# Altium project DL5-1AA.PrjPcb (part 2 of 3)

## Sheet PoE_Injector.SchDoc: IEEE 802.3AF/AT PSE Controller
size A3; CompanyName: FSCH; DrawnBy: ahorat / daniw; Engineer: ahorat / daniw; Address1: FS Switzerland; Address2: Zeltweg 57; Address3: 8032 Zürich; SheetNumber: 5; SheetTotal: 9
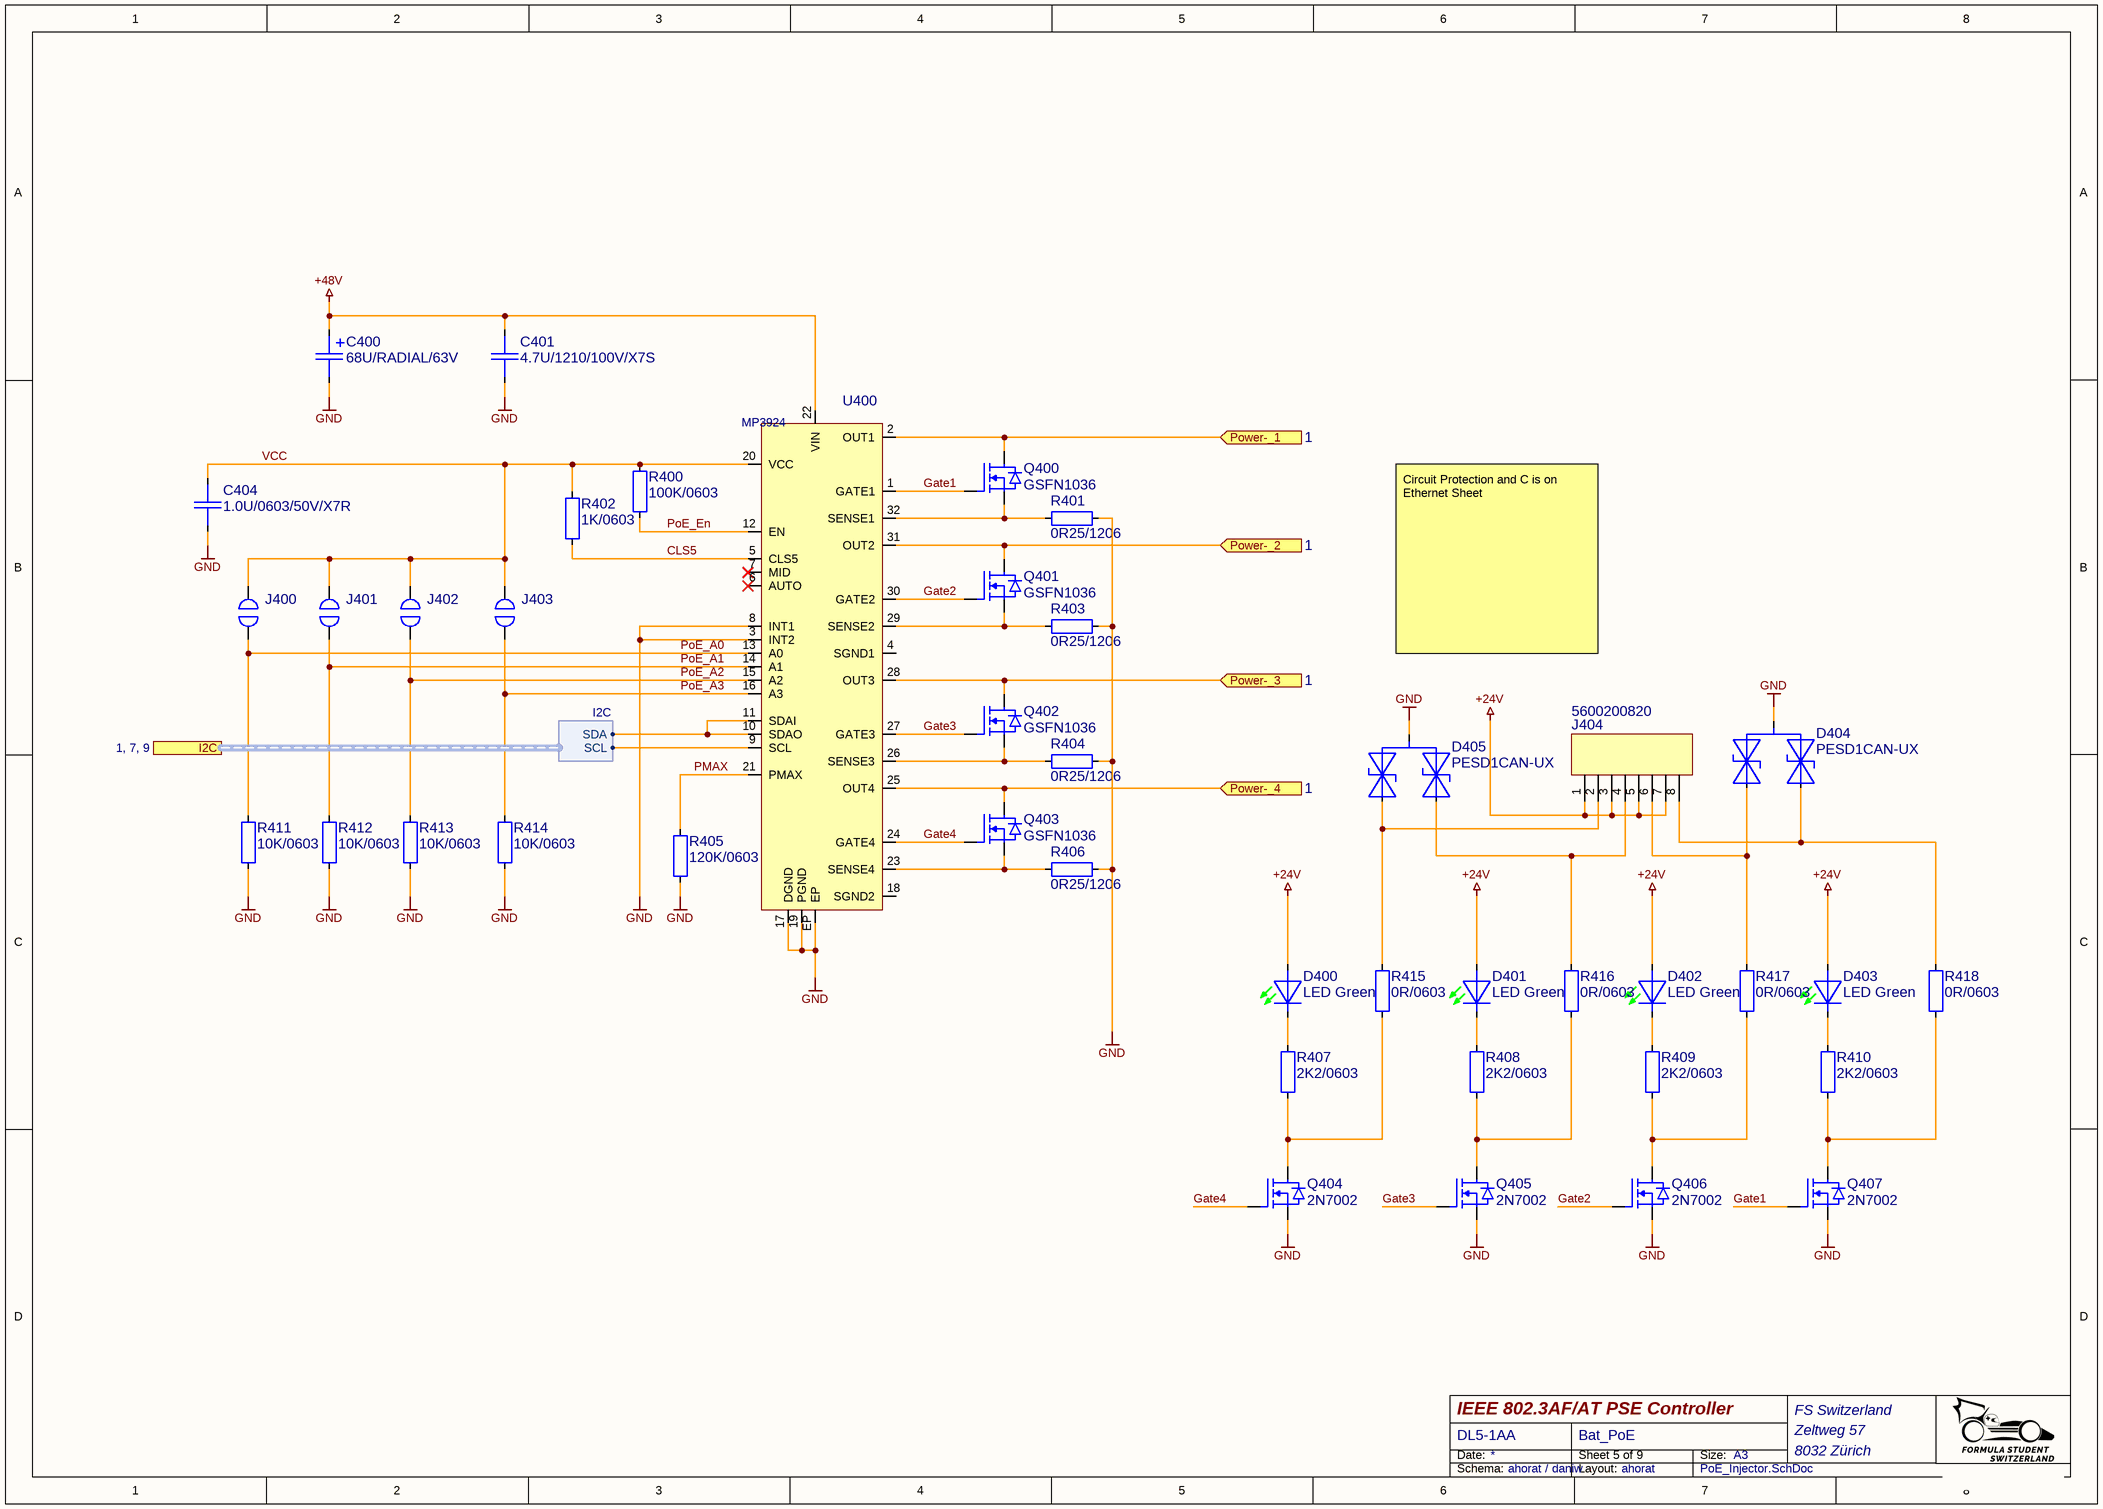
[diagram p4: PoE_Injector.SchDoc]

### Parts
C400  68U/RADIAL/63V  [CAP350P80X130]
C401  4.7U/1210/100V/X7S  [CAP1210_X7R]
C404  1.0U/0603/50V/X7R  [CAP0603_X7R]
D400  LED Green  [LED0603_GREEN]
D401  LED Green  [LED0603_GREEN]
D402  LED Green  [LED0603_GREEN]
D403  LED Green  [LED0603_GREEN]
D404  PESD1CAN-UX  [SOT65P210X95-3-SE]
D405  PESD1CAN-UX  [SOT65P210X95-3-SE]
J400  Solder Jumper 2pin 0.2mm small  [Solder_Jumper_2pin_0.2mm_small]  (value not drawn)
J401  Solder Jumper 2pin 0.2mm small  [Solder_Jumper_2pin_0.2mm_small]  (value not drawn)
J402  Solder Jumper 2pin 0.2mm small  [Solder_Jumper_2pin_0.2mm_small]  (value not drawn)
J403  Solder Jumper 2pin 0.2mm small  [Solder_Jumper_2pin_0.2mm_small]  (value not drawn)
J404  5600200820  [5600200820]
Q400  GSFN1036  [SON065P330X330X075-5-TH245X175]
Q401  GSFN1036  [SON065P330X330X075-5-TH245X175]
Q402  GSFN1036  [SON065P330X330X075-5-TH245X175]
Q403  GSFN1036  [SON065P330X330X075-5-TH245X175]
Q404  2N7002  [SOT2395P280X125-3-SE]
Q405  2N7002  [SOT2395P280X125-3-SE]
Q406  2N7002  [SOT2395P280X125-3-SE]
Q407  2N7002  [SOT2395P280X125-3-SE]
R400  100K/0603  [R0603-0.40-WW]
R401  0R25/1206  [R1206-0.80-WW]
R402  1K/0603  [R0603-0.40-WW]
R403  0R25/1206  [R1206-0.80-WW]
R404  0R25/1206  [R1206-0.80-WW]
R405  120K/0603  [R0603-0.40-WW]
R406  0R25/1206  [R1206-0.80-WW]
R407  2K2/0603  [R0603-0.40-WW]
R408  2K2/0603  [R0603-0.40-WW]
R409  2K2/0603  [R0603-0.40-WW]
R410  2K2/0603  [R0603-0.40-WW]
R411  10K/0603  [R0603-0.40-WW]
R412  10K/0603  [R0603-0.40-WW]
R413  10K/0603  [R0603-0.40-WW]
R414  10K/0603  [R0603-0.40-WW]
R415  0R/0603  [R0603-0.40-WW]
R416  0R/0603  [R0603-0.40-WW]
R417  0R/0603  [R0603-0.40-WW]
R418  0R/0603  [R0603-0.40-WW]
U400  MP3924  [QFN050P500X500X100-32-TH360X360]

### Ports
I2C (harness I2C, see 1, 7, 9), Power-_1 (in, see 1), Power-_2 (in, see 1), Power-_3 (in, see 1), Power-_4 (in, see 1)

### Harnesses
I2C: SCL, SDA

### Nets
+24V: D400.2 D401.2 D402.2 D403.2 J404.1 J404.3 J404.5 J404.7
+48V: C400.1 C401.1 U400.22(VIN)
GND: C400.2 C401.2 C404.2 D404.3 D405.3 Q404.2(SOURCE) Q405.2(SOURCE) Q406.2(SOURCE) Q407.2(SOURCE) R401.2 R403.2 R404.2 R405.2 R406.2 R411.2 R412.2 R413.2 R414.2 U400.3(INT2) U400.8(INT1) U400.17(DGND) U400.19(PGND) U400.EP
CLS5: R402.2 U400.5(CLS5)
Gate1: Q400.G(GATE) Q407.1(GATE) U400.1(GATE1)
Gate2: Q401.G(GATE) Q406.1(GATE) U400.30(GATE2)
Gate3: Q402.G(GATE) Q405.1(GATE) U400.27(GATE3)
Gate4: Q403.G(GATE) Q404.1(GATE) U400.24(GATE4)
I2C.SCL: U400.9(SCL) ; port I2C.SCL
I2C.SDA: U400.10(SDAO) U400.11(SDAI) ; port I2C.SDA
PMAX: R405.1 U400.21(PMAX)
PoE_A0: J400.2 R411.1 U400.13(A0)
PoE_A1: J401.2 R412.1 U400.14(A1)
PoE_A2: J402.2 R413.1 U400.15(A2)
PoE_A3: J403.2 R414.1 U400.16(A3)
PoE_En: R400.2 U400.12(EN)
VCC: C404.1 J400.1 J401.1 J402.1 J403.1 R400.1 R402.1 U400.20(VCC)
NetC510_Ethernet_Channel_1_2: Q400.D(DRAIN) U400.2(OUT1) ; port Power-_1
NetC510_Ethernet_Channel_2_2: Q401.D(DRAIN) U400.31(OUT2) ; port Power-_2
NetC510_Ethernet_Channel_3_2: Q402.D(DRAIN) U400.28(OUT3) ; port Power-_3
NetC510_Ethernet_Channel_4_2: Q403.D(DRAIN) U400.25(OUT4) ; port Power-_4
NetD400_1: D400.1 R407.1
NetD401_1: D401.1 R408.1
NetD402_1: D402.1 R409.1
NetD403_1: D403.1 R410.1
NetD404_1: D404.1 J404.8 R418.1
NetD404_2: D404.2 J404.6 R417.1
NetD405_1: D405.1 J404.4 R416.1
NetD405_2: D405.2 J404.2 R415.1
NetQ400_S: Q400.S(SOURCE) R401.1 U400.32(SENSE1)
NetQ401_S: Q401.S(SOURCE) R403.1 U400.29(SENSE2)
NetQ402_S: Q402.S(SOURCE) R404.1 U400.26(SENSE3)
NetQ403_S: Q403.S(SOURCE) R406.1 U400.23(SENSE4)
NetQ404_3: Q404.3(DRAIN) R407.2 R415.2
NetQ405_3: Q405.3(DRAIN) R408.2 R416.2
NetQ406_3: Q406.3(DRAIN) R409.2 R417.2
NetQ407_3: Q407.3(DRAIN) R410.2 R418.2

Not connected (* = marked no-connect by the designer): U400 4(SGND1) 6(AUTO)* 7(MID)* 18(SGND2)

### Notes on the sheet
- Circuit Protection and C is on Ethernet Sheet
- Date:
- Size:
- A3
- Schema:
- Layout:

### Library data of the parts
C400 = 68U/RADIAL/63V: CAP THT 8C130 68UF ELKO 63V; Manufacturer: GENERIC; Manufacturer 1: Würth Elektronik; Manufacturer Part Number 1: 860020774014; Absolute Value: 6.8E-5; Part Number: 68U/RADIAL/63V; Package: RADIAL; Value: 68UF; HelpURL: https://www.we-online.com/components/products/datasheet/860020774014.pdf; Supplier 1: Digi-Key; Supplier Part Number 1: 732-8975-1-ND; Manufacturer Part Number 3: LKMD0901K680MF; Supplier 3: LCSC; Supplier Part Number 3: C443065
C401 = 4.7U/1210/100V/X7S: CAP SM 1210 4.7uF 100V X7S; Manufacturer: GENERIC; Manufacturer 1: Murata; Manufacturer Part Number 1: GRM31CC72A475ME11L; Absolute Value: 4.7E-6; Eurocircuits GPN: GPN1210475-100; Part Number: 4.7U/1210/100V/X7S; Package: 1210; Value: 4.7uF; HelpURL: https://search.murata.co.jp/Ceramy/image/img/A01X/G101/ENG/GRM31CC72A475ME11-01A.pdf; Supplier 1: Digi-Key; Supplier Part Number 1: 490-18621-1-ND; Manufacturer Part Number 3: CGA1210X7S475K101RT; Supplier 3: LCSC; Supplier Part Number 3: C6120041
C404 = 1.0U/0603/50V/X7R: CAP SM 0603 1.0uF 50V X7R; Manufacturer: GENERIC; Manufacturer 1: YAGEO; Manufacturer Part Number 1: CC0603KRX7R9BB105; Absolute Value: 1E-6; Eurocircuits GPN: GPC0603105; Part Number: 1.0U/0603/50V/X7R; Package: 0603; Value: 1.0uF; HelpURL: https://www.yageo.com/upload/media/product/app/datasheet/mlcc/upy-gphc_x7r_6_3v-to-250v.pdf; Supplier 1: Digi-Key; Supplier Part Number 1: 311-2082-1-ND
D400-D403 = LED Green 0603: Generic LED Green 0603; Manufacturer 1: Würth; Manufacturer Part Number 1: 150060VS75000; Part Number: LED Green 0603; Manufacturer: GENERIC; Package: 603; Value: Green; Absolute Value: Green; HelpURL: https://www.we-online.com/katalog/datasheet/150060VS75000.pdf; Supplier 1: Digikey; Supplier Part Number 1: 732-4980-1-ND; Manufacturer 3: Everlight Elec; Manufacturer Part Number 3: 19-217/GHC-YR1S2/3T; Supplier 3: LCSC; Supplier Part Number 3: C72043; JLC Type: Basic
D404 D405 = PESD1CAN-UX: CAN bus ESD protection diode; Manufacturer: Nexperia USA Inc.; Absolute Value: 24V; Part Number: PESD1CAN-UX; Package: SOT323; Value: PESD1CAN-UX; HelpURL: https://assets.nexperia.com/documents/data-sheet/PESD1CAN-U.pdf; Manufacturer 1: Nexperia USA Inc.; Manufacturer Part Number 1: PESD1CAN-UX; Supplier 1: Digikey; Supplier Part Number 1: 1727-1306-1-ND; Manufacturer 3: Nexperia; Manufacturer Part Number 3: PESD1CAN-UX; Supplier 3: LCSC; Supplier Part Number 3: C152727
J400-J403 = Solder_Jumper_2pin_0.2mm_small: Solder jumper with two pins with a spacing of 0.2mm; Manufacturer: NONE; Part Number: Solder_Jumper_2pin_0.2mm_small
J404 = DuraClick_1x8_VERT_SMD: DuraClik Wire-to-Board Header, Single Row, Vertical, 8 Circuits, Tin (Sn) Over Nickel, Natural; Manufacturer 1: Molex; Part Number: DuraClick_1x8_VERT_SMD; HelpURL: https://www.molex.com/en-us/products/part-detail/5600200820; Manufacturer Part Number 1: 5600200820; Supplier 1: Digi-Key; Supplier Part Number 1: WM10868CT-ND; Manufacturer: Molex
Q400-Q403 = GSFN1036: N-Kanal 100 V 35 A (Tc) 52W (Tc) Oberflächenmontage 8-PPAK (3,1x3,05); Manufacturer: Good-Ark Semiconductor; Part Number: GSFN1036; Package: 8-PowerVDFN; Manufacturer 1: Good-Ark Semiconductor; Manufacturer Part Number 1: GSFN1036; Supplier 1: Digi-Key; Supplier Part Number 1: 4786-GSFN1036CT-ND; HelpURL: https://goodarksemi.com/docs/datasheets/mosfets/GSFN1036.pdf
Q404-Q407 = 2N7002: 60V 115mA 1.2Ω@10V,500mA 200mW 2.1V@250uA N Channel SOT-23 MOSFETs; Manufacturer: GENERIC; Manufacturer 1: Nexperia USA Inc.; Manufacturer Part Number 1: 2N7002NXAKR; Part Number: 2N7002; Package: SOT23; HelpURL: https://assets.nexperia.com/documents/data-sheet/2N7002NXAK.pdf; Supplier 1: Digi-Key; Supplier Part Number 1: 1727-8643-1-ND; Manufacturer 3: JSMSEMI; Manufacturer Part Number 3: JSMSEMI; Supplier 3: LCSC; Supplier Part Number 3: C916396; JLC Type: Extended
R400 = 100K/0603: RES SM 0603 100K; Manufacturer: GENERIC; Manufacturer 1: YAGEO; Manufacturer Part Number 1: RC0603FR-13100KL; Absolute Value: 100000; Eurocircuits GPN: GPR0603100K; Part Number: 100K/0603; Package: 0603; Value: 100K; HelpURL: https://www.yageo.com/upload/media/product/productsearch/datasheet/rchip/PYu-RC_Group_51_RoHS_L_12.pdf; Supplier 1: Digi-Key; Supplier Part Number 1: 13-RC0603FR-13100KLCT-ND; Manufacturer 2: YAGEO; Manufacturer Part Number 2: RC0603FR-10100KL; Supplier 2: Digi-Key; Supplier Part Number 2: 13-RC0603FR-10100KLCT-ND; Manufacturer 3: UNI-ROYAL(Uniroyal Elec); Manufacturer Part Number 3: 0603WAF1003T5E; Supplier 3: LCSC; Supplier Part Number 3: C25803; JLC Type: Basic
R401 R403 R404 R406 = 0R25/1206: RES SM 1206 0R25; Manufacturer: GENERIC; Manufacturer 1: YAGEO; Manufacturer Part Number 1: RL1206FR-070R25L; Absolute Value: 0.25; Eurocircuits GPN: GPR12060R25; Part Number: 0R25/1206; Package: 1206; Value: 0R25; HelpURL: https://www.yageo.com/upload/media/product/app/datasheet/rchip/pyu-rl_group_521_rohs_l.pdf; Supplier 1: Digi-Key; Supplier Part Number 1: 311-.25LWCT-ND; Manufacturer 3: RALEC; Manufacturer Part Number 3: RLT06R25JTP; Supplier 3: LCSC; Supplier Part Number 3: C7500327
R402 = 1K/0603: RES SM 0603 1K; Manufacturer: GENERIC; Manufacturer 1: YAGEO; Manufacturer Part Number 1: RC0603FR-131KL; Absolute Value: 1000; Eurocircuits GPN: GPR06031K; Part Number: 1K/0603; Package: 0603; Value: 1K; HelpURL: https://www.yageo.com/upload/media/product/app/datasheet/rchip/pyu-rc_group_51_rohs_l.pdf; Supplier 1: Digi-Key; Supplier Part Number 1: 13-RC0603FR-131KLCT-ND; Manufacturer 2: YAGEO; Manufacturer Part Number 2: RC0603FR-101KL; Supplier 2: Digi-Key; Supplier Part Number 2: 13-RC0603FR-101KLCT-ND; Manufacturer 3: UNI-ROYAL(Uniroyal Elec); Manufacturer Part Number 3: 0603WAF1001T5E; Supplier 3: LCSC; Supplier Part Number 3: C21190; JLC Type: Basic
R405 = 120K/0603: RES SM 0603 120K; Manufacturer: GENERIC; Manufacturer 1: YAGEO; Manufacturer Part Number 1: RC0603FR-13120KL; Absolute Value: 120000; Eurocircuits GPN: GPR0603120K; Part Number: 120K/0603; Package: 0603; Value: 120K; HelpURL: https://www.yageo.com/upload/media/product/app/datasheet/rchip/pyu-rc_group_51_rohs_l.pdf; Supplier 1: Digi-Key; Supplier Part Number 1: 13-RC0603FR-13120KLCT-ND; Manufacturer 2: YAGEO; Manufacturer Part Number 2: RC0603FR-10120KL; Supplier 2: Digi-Key; Supplier Part Number 2: 13-RC0603FR-10120KLCT-ND
R407-R410 = 2K2/0603: RES SM 0603 2K2; Manufacturer: GENERIC; Manufacturer 1: YAGEO; Manufacturer Part Number 1: RC0603FR-132K2L; Absolute Value: 2200; Eurocircuits GPN: GPR06032K2; Part Number: 2K2/0603; Package: 0603; Value: 2K2; HelpURL: https://www.yageo.com/upload/media/product/app/datasheet/rchip/pyu-rc_group_51_rohs_l.pdf; Supplier 1: Digi-Key; Supplier Part Number 1: 13-RC0603FR-132K2LCT-ND; Manufacturer 2: YAGEO; Manufacturer Part Number 2: RC0603FR-102K2L; Supplier 2: Digi-Key; Supplier Part Number 2: 13-RC0603FR-102K2LCT-ND; Manufacturer 3: YAGEO; Manufacturer Part Number 3: RC0603JR-072K2L; Supplier 3: LCSC; Supplier Part Number 3: C113303
R411-R414 = 10K/0603: RES SM 0603 10K; Manufacturer: GENERIC; Manufacturer 1: YAGEO; Manufacturer Part Number 1: RC0603FR-1310KL; Absolute Value: 10000; Eurocircuits GPN: GPR060310K; Part Number: 10K/0603; Package: 0603; Value: 10K; HelpURL: https://www.yageo.com/upload/media/product/productsearch/datasheet/rchip/PYu-RC_Group_51_RoHS_L_12.pdf; Supplier 1: Digi-Key; Supplier Part Number 1: 13-RC0603FR-1310KLCT-ND; Manufacturer 2: YAGEO; Manufacturer Part Number 2: RC0603FR-1010KL; Supplier 2: Digi-Key; Supplier Part Number 2: 13-RC0603FR-1010KLCT-ND; Manufacturer 3: UNI-ROYAL(Uniroyal Elec); Manufacturer Part Number 3: 0603WAF1002T5E; Supplier 3: LCSC; Supplier Part Number 3: C25804; JLC Type: Basic
R415-R418 = 0R/0603: RES SM 0603 0R; Manufacturer: GENERIC; Manufacturer 1: YAGEO; Manufacturer Part Number 1: RC0603FR-070RL; Absolute Value: 0; Eurocircuits GPN: GPR06030R; Part Number: 0R/0603; Package: 0603; Value: 0R; HelpURL: https://www.yageo.com/upload/media/product/app/datasheet/rchip/pyu-rc_group_51_rohs_l.pdf; Supplier 1: Digi-Key; Supplier Part Number 1: 311-0.0HRCT-ND; Manufacturer 2: YAGEO; Manufacturer Part Number 2: RC0603FR-130RL; Supplier 2: Digi-Key; Supplier Part Number 2: 13-RC0603FR-130RLCT-ND; Manufacturer 3: UNI-ROYAL(Uniroyal Elec); Manufacturer Part Number 3: 0603WAF0000T5E; Supplier 3: LCSC; Supplier Part Number 3: C21189; JLC Type: Basic
U400 = MP3924: Quad-Port, IEEE 802.3af/at PSE Controller for Power over Ethernet; Manufacturer: MPS; Manufacturer 1: Monolithic Power Systems Inc.; Manufacturer Part Number 1: MP3924GU-Z; Part Number: MP3924; Package: QFN-32; HelpURL: https://www.monolithicpower.com/en/documentview/productdocument/index/version/2/document_type/Datasheet/lang/en/sku/MP3924GU/document_id/9919/; Supplier 1: Digi-Key; Supplier Part Number 1: 1589-MP3924GU-ZCT-ND

## Sheet Mains.SchDoc: Mains Interface
size A3; CompanyName: FSCH; DrawnBy: ahorat / daniw; Engineer: ahorat / daniw; Address1: FS Switzerland; Address2: Zeltweg 57; Address3: 8032 Zürich; SheetNumber: 2; SheetTotal: 9
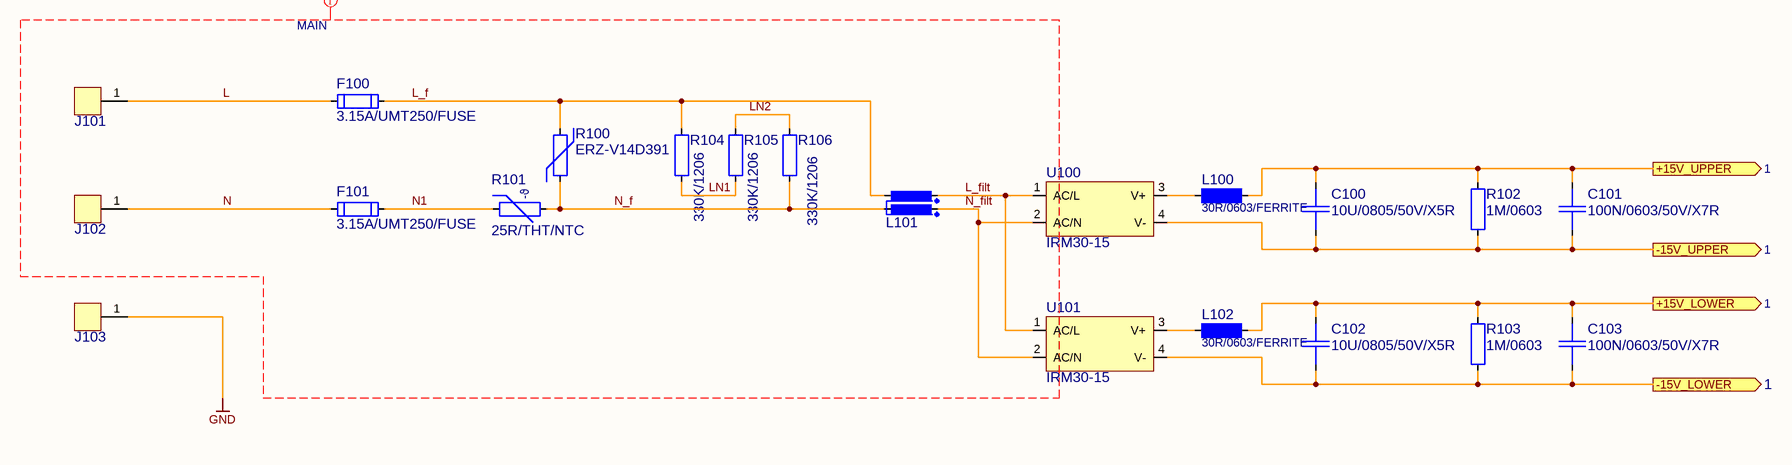
[diagram p5: Mains.SchDoc]

### Parts
C100  10U/0805/50V/X5R  [CAP0805_X7R]
C101  100N/0603/50V/X7R  [CAP0603_X7R]
C102  10U/0805/50V/X5R  [CAP0805_X7R]
C103  100N/0603/50V/X7R  [CAP0603_X7R]
F100  3.15A/UMT250/FUSE  [UMT250]
F101  3.15A/UMT250/FUSE  [UMT250]
J101  6.35mmx0.81mm Tab THT  [Tab_THT_635]  (value not drawn)
J102  6.35mmx0.81mm Tab THT  [Tab_THT_635]  (value not drawn)
J103  6.35mmx0.81mm Tab THT  [Tab_THT_635]  (value not drawn)
L100  30R/0603/FERRITE  [FB0603]
L101  1MH/THT/CMC  [DFKH-CASE-50-2]  (value not drawn)
L102  30R/0603/FERRITE  [FB0603]
R100  ERZ-V14D391  [RESD750W80D155]
R101  25R/THT/NTC  [RESD500W60D115]
R102  1M/0603  [R0603-0.40-WW]
R103  1M/0603  [R0603-0.40-WW]
R104  330K/1206  [R1206-0.80-WW]
R105  330K/1206  [R1206-0.80-WW]
R106  330K/1206  [R1206-0.80-WW]
U100  IRM30-15  [IRM30]
U101  IRM30-15  [IRM30]

### Ports
+15V_LOWER (out, see 1), +15V_UPPER (out, see 1), -15V_LOWER (out, see 1), -15V_UPPER (out, see 1)

### Nets
GND: C102.2 C103.2 J103.1 R103.2 U101.4(V-) ; port -15V_LOWER
GND_BAT: C100.2 C101.2 R102.2 U100.4(V-) ; port -15V_UPPER
L: F100.1 J101.1
L_f: F100.2 L101.3 R100.1 R104.1
L_filt: L101.1 U100.1(AC/L) U101.1(AC/L)
LN1: R104.2 R105.2
LN2: R105.1 R106.1
N: F101.1 J102.1
N1: F101.2 R101.1
N_f: L101.4 R100.2 R101.2 R106.2
N_filt: L101.2 U100.2(AC/N) U101.2(AC/N)
NetC100_1: C100.1 C101.1 L100.2 R102.1 ; port +15V_UPPER
NetC102_1: C102.1 C103.1 L102.2 R103.1 ; port +15V_LOWER
NetL100_1: L100.1 U100.3(V+)
NetL102_1: L102.1 U101.3(V+)

### Layout directives
net class MAIN: L, L_f, L_filt, LN1, LN2, N, N1, N_f, N_filt

### Notes on the sheet
- Date:
- Size:
- A3
- Schema:
- Layout:
- (in symbol 25R/THT/NTC) -ϑ

### Library data of the parts
C100 C102 = 10U/0805/50V/X5R: CAP SM 0805 10uF 50V X5R; Manufacturer: GENERIC; Manufacturer 1: Murata Electronics; Manufacturer Part Number 1: GRM21BR61H106KE43K; Absolute Value: 1E-5; Eurocircuits GPN: GPN0805106-50-X5R; Part Number: 10U/0805/50V/X5R; Package: 0805; Value: 10uF; HelpURL: https://search.murata.co.jp/Ceramy/image/img/A01X/G101/ENG/GRM21BR61H106KE43-01A.pdf; Supplier 1: Digi-Key; Supplier Part Number 1: 490-GRM21BR61H106KE43KCT-ND; Manufacturer Part Number 3: GRM21BR61H106KE43L; Supplier 3: LCSC; Supplier Part Number 3: C440198; JLC Type: Basic
C101 C103 = 100N/0603/50V/X7R: CAP SM 0603 100nF 50V X7R; Manufacturer: GENERIC; Manufacturer 1: YAGEO; Manufacturer Part Number 1: CC0603KPX7R9BB104; Absolute Value: 1E-7; Eurocircuits GPN: GPC0603104; Part Number: 100N/0603/50V/X7R; Package: 0603; Value: 100nF; HelpURL: https://www.yageo.com/upload/media/product/app/datasheet/mlcc/upy-gphc_x7r_6_3v-to-250v.pdf; Supplier 1: Digi-Key; Supplier Part Number 1: 311-3567-1-ND; Manufacturer 2: YAGEO; Manufacturer Part Number 2: CC0603MRX7R9BB104; Supplier 2: Digi-Key; Supplier Part Number 2: 311-4110-1-ND; Supplier 3: LCSC; Supplier Part Number 3: C14663; JLC Type: Basic
F100 F101 = 3.15A/UMT250/FUSE: Fuse 250VAC 3.15A UMT250; Manufacturer: Schurter; Manufacturer Part Number 1: 3403.0171.24; Absolute Value: 3.15; Part Number: 3.15A/UMT250/FUSE; Package: UMT250; HelpURL: https://www.schurter.com/en/datasheet/typ_UMT_250.pdf; Manufacturer 1: Schurter; Supplier 1: Digi-Key; Supplier Part Number 1: 486-3482-1-ND; Value: 3.15A
J101-J103 = Tab_025_THT: CONN QC TAB 0.250 SOLDER; Manufacturer: GENERIC; Manufacturer 1: TE Connectivity AMP Connectors; Manufacturer Part Number 1: 1217861-1; Part Number: Tab_025_THT; HelpURL: https://www.te.com/usa-en/product-1217861-1.datasheet.pdf; Supplier 1: Digi-Key; Supplier Part Number 1: A100452CT-ND; Manufacturer 3: TE Connectivity; Manufacturer Part Number 3: 1217861-1; Supplier 3: LCSC; Supplier Part Number 3: C428480
L100 L102 = 30R/0603/FERRITE: 30R@100MHz 5A 0603 Ferrite; Manufacturer: GENERIC; Manufacturer 1: Laird-Signal Integrity Products; Manufacturer Part Number 1: HI0603R300R-10; Value: 30R; Absolute Value: 1000; Part Number: 30R/0603/FERRITE; Package: 603; HelpURL: https://www.laird.com/document/datasheet/hi0603r300r-10-datasheet; Supplier 1: Digi-Key; Supplier Part Number 1: 240-HI0603R300R-10CT-ND
L101 = 1MH/THT/CMC: CMC 1mH 2A THT Schurter DFKH-14-0003; Manufacturer 1: SCHURTER Inc.; Part Number: 1MH/THT/CMC; Manufacturer: SCHURTER; Package: 15X10.5mm; Value: 1MH; HelpURL: https://www.schurter.com/en/datasheet/typ_DFKH.pdf; Manufacturer Part Number 1: DFKH-14-0003; Supplier 1: Digi-Key; Supplier Part Number 1: 486-3121-ND
R100 = ERZ-V14D391: VARISTOR 391V 6kA; Manufacturer: GENERIC; Manufacturer 1: Panasonic Electronic Components; Absolute Value: 391; Part Number: ERZ-V14D391; Package: 7.5mm; Value: 391V; HelpURL: https://industrial.panasonic.com/cdbs/www-data/pdf/AWA0000/AWA0000C1.pdf; Manufacturer Part Number 1: ERZ-V14D391; Supplier 1: Digi-Key; Supplier Part Number 1: P7266-ND
R101 = 25R/THT/NTC: RES NTC THT 5 25R; Manufacturer: GENERIC; Manufacturer 1: EPCOS - TDK Electronics; Manufacturer Part Number 1: B57236S0250M000; Absolute Value: 25; Part Number: 25R/THT/NTC; Package: 5mm; Value: 25R; HelpURL: https://product.tdk.com/system/files/dam/doc/product/protection/current/ntc-limiter/data_sheet/50/db/icl_16/s236.pdf; Supplier 1: Digi-Key; Supplier Part Number 1: 495-3048-ND
R102 R103 = 1M/0603: RES SM 0603 1M; Manufacturer: GENERIC; Manufacturer 1: YAGEO; Manufacturer Part Number 1: RC0603FR-131ML; Absolute Value: 1000000; Eurocircuits GPN: GPR06031M; Part Number: 1M/0603; Package: 0603; Value: 1M; HelpURL: https://www.yageo.com/upload/media/product/app/datasheet/rchip/pyu-rc_group_51_rohs_l.pdf; Supplier 1: Digi-Key; Supplier Part Number 1: 13-RC0603FR-131MLCT-ND; Manufacturer 2: YAGEO; Manufacturer Part Number 2: RC0603FR-101ML; Supplier 2: Digi-Key; Supplier Part Number 2: 13-RC0603FR-101MLCT-ND; Manufacturer 3: UNI-ROYAL(Uniroyal Elec); Manufacturer Part Number 3: 0603WAF1004T5E; Supplier 3: C22935; Supplier Part Number 3: LCSC; JLC Type: Basic
R104-R106 = 330K/1206: RES SM 1206 330K; Manufacturer: GENERIC; Manufacturer 1: YAGEO; Manufacturer Part Number 1: RC1206FR-07330KL; Absolute Value: 330000; Part Number: 330K/1206; Package: 1206; Value: 330K; HelpURL: https://www.yageo.com/upload/media/product/products/datasheet/rchip/PYu-RC_Group_51_RoHS_L_12.pdf; Supplier 1: Digi-Key; Supplier Part Number 1: 311-330KFRCT-ND
U100 U101 = IRM30-15: 30W AC-DC PCB-Mount Green Power Module; Part Number: IRM30-15; Package: Module; HelpURL: https://www.meanwell-web.com/content/files/pdfs/productPdfs/MW/IRM-30/IRM-30-spec.pdf

## Sheet Ethernet_Connector.SchDoc: RJ45 Connector
size A3; CompanyName: FSCH; DrawnBy: ahorat / daniw; Engineer: ahorat / daniw; Address1: FS Switzerland; Address2: Zeltweg 57; Address3: 8032 Zürich; SheetNumber: 6; SheetTotal: 9
Used 4 times, as channels Ethernet Channel 1, Ethernet Channel 2, Ethernet Channel 3, Ethernet Channel 4. Parts and nets are listed once, with the designators drawn on the sheet.
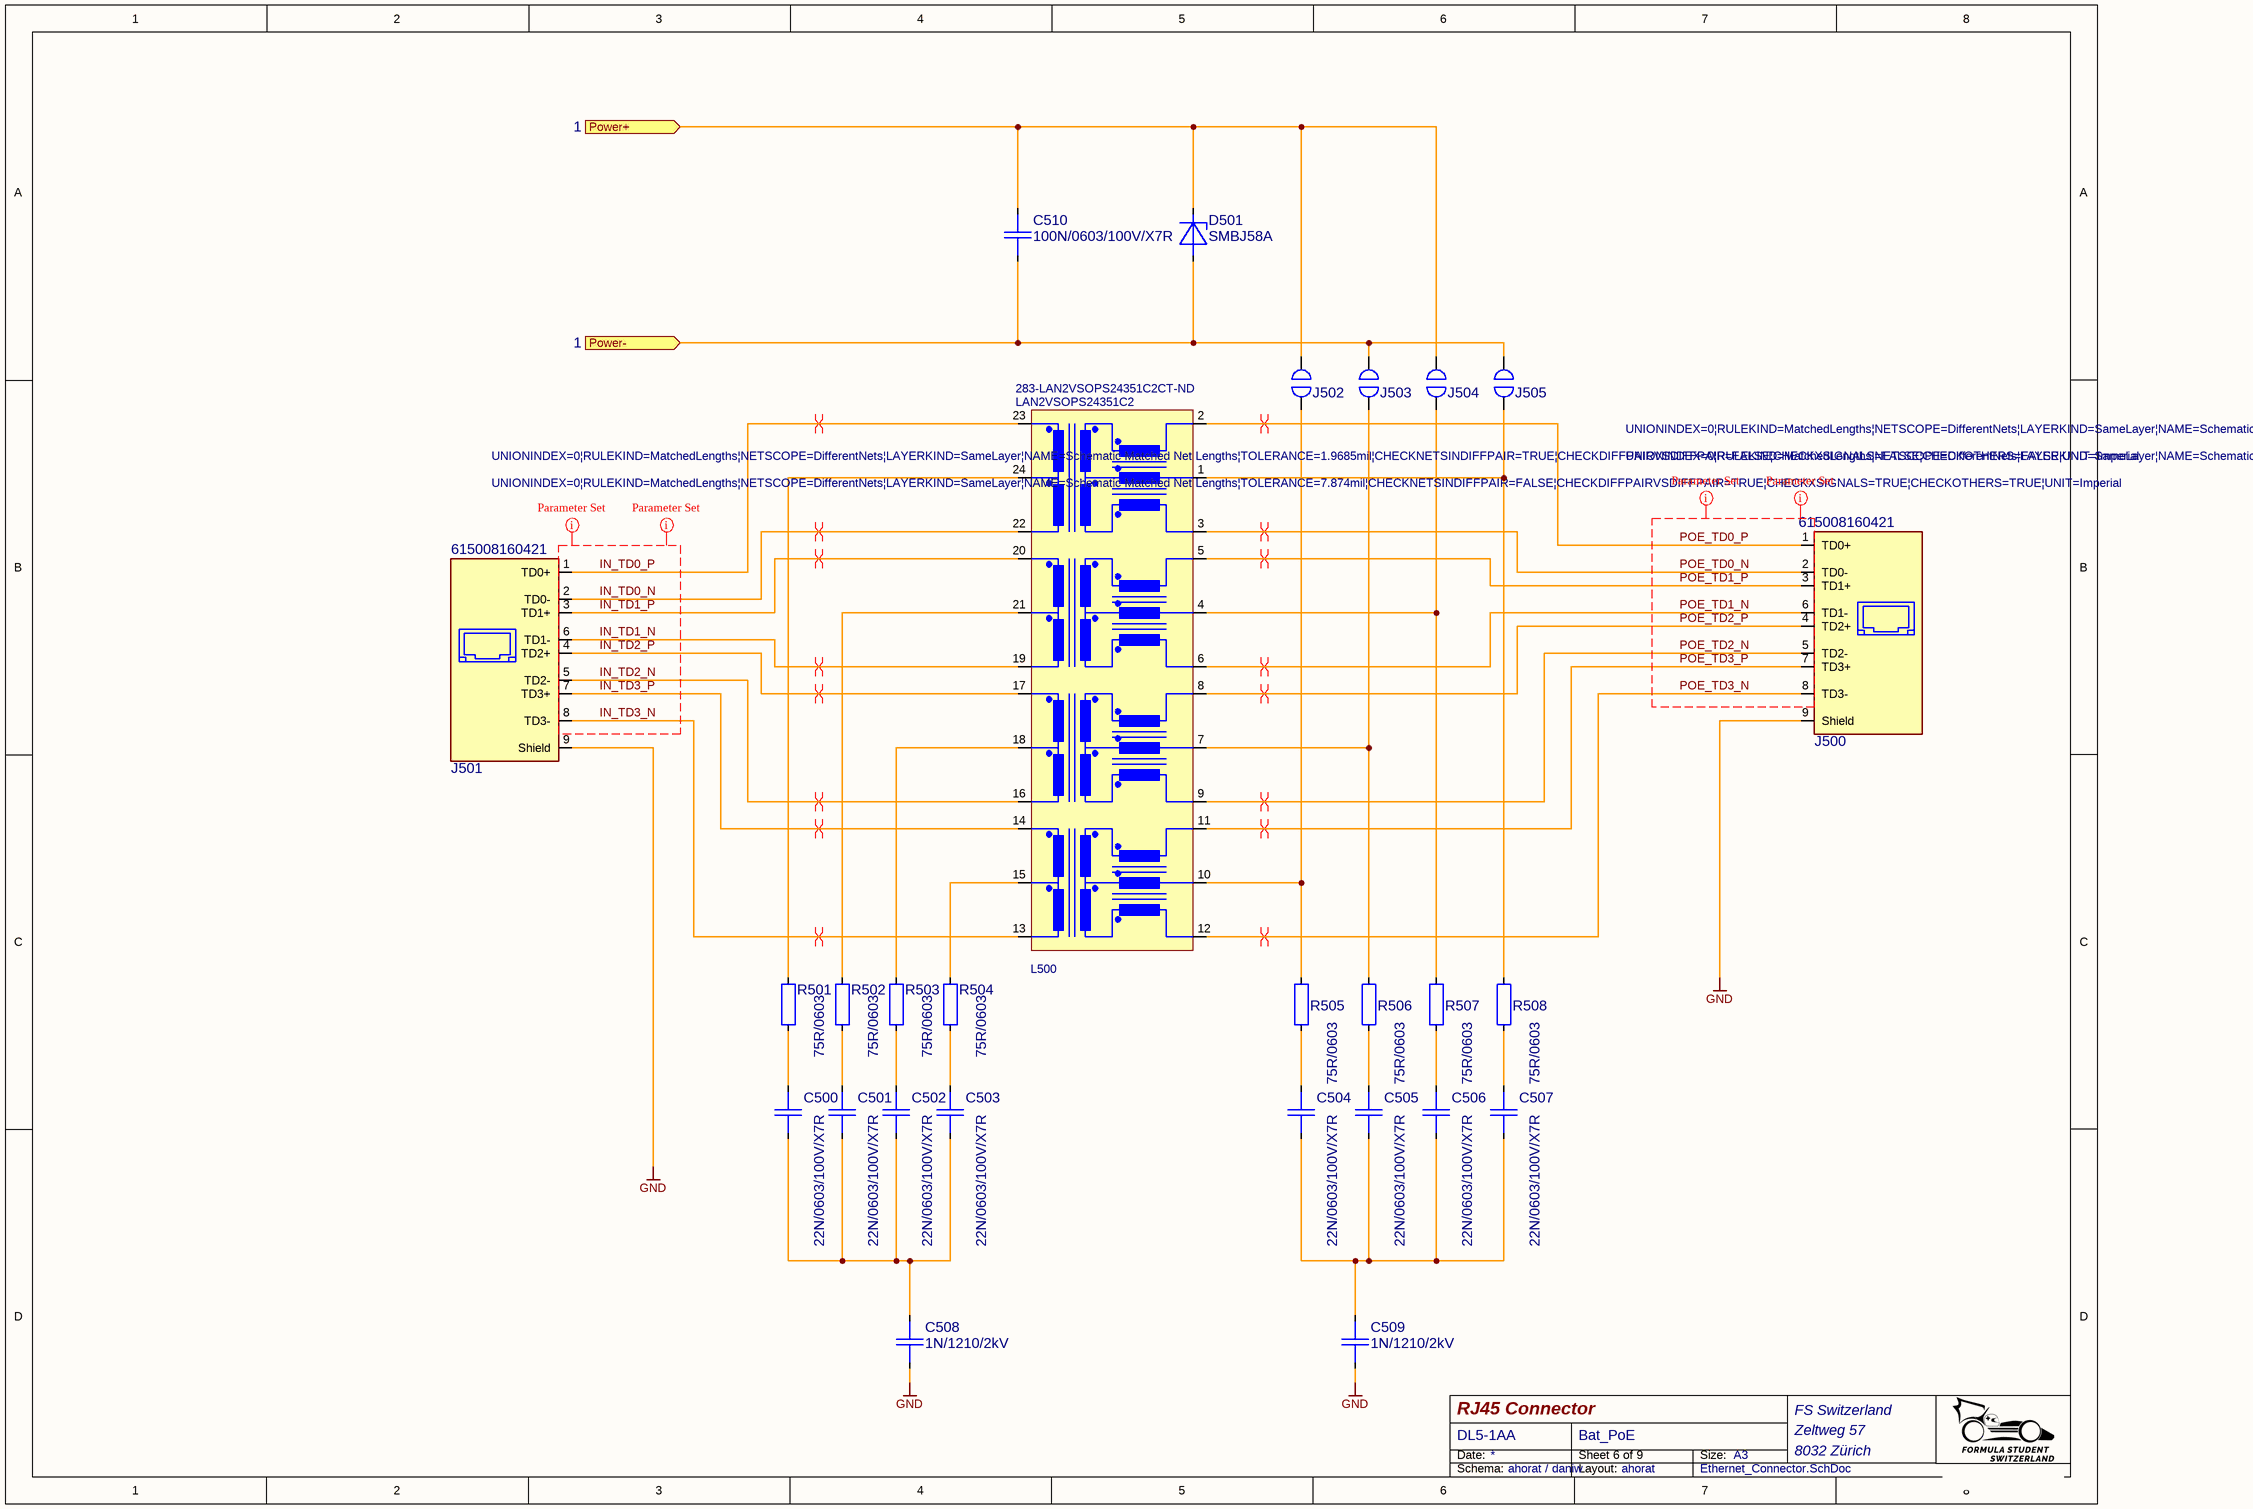
[diagram p6: Ethernet_Connector.SchDoc]

### Parts
C500  22N/0603/100V/X7R  [CAP0603_X7R]
C501  22N/0603/100V/X7R  [CAP0603_X7R]
C502  22N/0603/100V/X7R  [CAP0603_X7R]
C503  22N/0603/100V/X7R  [CAP0603_X7R]
C504  22N/0603/100V/X7R  [CAP0603_X7R]
C505  22N/0603/100V/X7R  [CAP0603_X7R]
C506  22N/0603/100V/X7R  [CAP0603_X7R]
C507  22N/0603/100V/X7R  [CAP0603_X7R]
C508  1N/1210/2kV  [CAP1210_X7R]
C509  1N/1210/2kV  [CAP1210_X7R]
C510  100N/0603/100V/X7R  [CAP0603_X7R]
D501  SMBJ58A  [DIOM5436X265]
J500  615008160421  [ETH_615008160421]
J501  615008160421  [ETH_615008160421]
J502  Solder Jumper 2pin 0.2mm small  [Solder_Jumper_2pin_0.2mm_small]  (value not drawn)
J503  Solder Jumper 2pin 0.2mm small  [Solder_Jumper_2pin_0.2mm_small]  (value not drawn)
J504  Solder Jumper 2pin 0.2mm small  [Solder_Jumper_2pin_0.2mm_small]  (value not drawn)
J505  Solder Jumper 2pin 0.2mm small  [Solder_Jumper_2pin_0.2mm_small]  (value not drawn)
L500  LAN2VSOPS24351C2  Supplier Part Number 1: 283-LAN2VSOPS24351C2CT-ND  [IND127P1600X620-24]
R501  75R/0603  [R0603-0.40-WW]
R502  75R/0603  [R0603-0.40-WW]
R503  75R/0603  [R0603-0.40-WW]
R504  75R/0603  [R0603-0.40-WW]
R505  75R/0603  [R0603-0.40-WW]
R506  75R/0603  [R0603-0.40-WW]
R507  75R/0603  [R0603-0.40-WW]
R508  75R/0603  [R0603-0.40-WW]

### Ports
Power+ (in, see 1), Power- (in, see 1)

### Nets
GND: C508.2 C509.2 J500.9(Shield) J501.9(Shield)
IN_TD0_N: J501.2(TD0-) L500.22
IN_TD0_P: J501.1(TD0+) L500.23
IN_TD1_N: J501.6(TD1-) L500.19
IN_TD1_P: J501.3(TD1+) L500.20
IN_TD2_N: J501.5(TD2-) L500.16
IN_TD2_P: J501.4(TD2+) L500.17
IN_TD3_N: J501.8(TD3-) L500.13
IN_TD3_P: J501.7(TD3+) L500.14
POE_TD0_N: J500.2(TD0-) L500.3
POE_TD0_P: J500.1(TD0+) L500.2
POE_TD1_N: J500.6(TD1-) L500.6
POE_TD1_P: J500.3(TD1+) L500.5
POE_TD2_N: J500.5(TD2-) L500.9
POE_TD2_P: J500.4(TD2+) L500.8
POE_TD3_N: J500.8(TD3-) L500.12
POE_TD3_P: J500.7(TD3+) L500.11
Power+: C510.1 D501.1 J502.1 J504.1 ; port Power+
Power-: C510.2 D501.2 J503.1 J505.1 ; port Power-
NetC500_1: C500.1 R501.2
NetC500_2: C500.2 C501.2 C502.2 C503.2 C508.1
NetC501_1: C501.1 R502.2
NetC502_1: C502.1 R503.2
NetC503_1: C503.1 R504.2
NetC504_1: C504.1 R505.2
NetC504_2: C504.2 C505.2 C506.2 C507.2 C509.1
NetC505_1: C505.1 R506.2
NetC506_1: C506.1 R507.2
NetC507_1: C507.1 R508.2
NetJ502_2: J502.2 L500.10 R505.1
NetJ503_2: J503.2 L500.7 R506.1
NetJ504_2: J504.2 L500.4 R507.1
NetJ505_2: J505.2 L500.1 R508.1
NetL500_15: L500.15 R504.1
NetL500_18: L500.18 R503.1
NetL500_21: L500.21 R502.1
NetL500_24: L500.24 R501.1

### Channels
Ethernet Channel 1: designators end in _Ethernet_Channel_1; ports Power+=+48V Power-=NetC510_Ethernet_Channel_1_2
Ethernet Channel 2: designators end in _Ethernet_Channel_2; ports Power+=+48V Power-=NetC510_Ethernet_Channel_2_2
Ethernet Channel 3: designators end in _Ethernet_Channel_3; ports Power+=+48V Power-=NetC510_Ethernet_Channel_3_2
Ethernet Channel 4: designators end in _Ethernet_Channel_4; ports Power+=+48V Power-=NetC510_Ethernet_Channel_4_2

### Layout directives
differential pair: IN_TD0_N_Ethernet Channel 1, IN_TD0_P_Ethernet Channel 1, IN_TD1_N_Ethernet Channel 1, IN_TD1_P_Ethernet Channel 1, IN_TD2_N_Ethernet Channel 1, IN_TD2_P_Ethernet Channel 1, IN_TD3_N_Ethernet Channel 1, IN_TD3_P_Ethernet Channel 1, POE_TD0_N_Ethernet Channel 1, POE_TD0_P_Ethernet Channel 1, POE_TD1_N_Ethernet Channel 1, POE_TD1_P_Ethernet Channel 1, POE_TD2_N_Ethernet Channel 1, POE_TD2_P_Ethernet Channel 1, POE_TD3_N_Ethernet Channel 1, POE_TD3_P_Ethernet Channel 1
rule Matched Net Lengths [Tolerance = 1.968mil]; net class Ethernet_In: IN_TD0_N, IN_TD0_P, IN_TD1_N, IN_TD1_P, IN_TD2_N, IN_TD2_P, IN_TD3_N, IN_TD3_P
rule Matched Net Lengths [Tolerance = 7.874mil]; net class Ethernet_In: IN_TD0_N, IN_TD0_P, IN_TD1_N, IN_TD1_P, IN_TD2_N, IN_TD2_P, IN_TD3_N, IN_TD3_P
rule Matched Net Lengths [Tolerance = 1.968mil]; net class Ethernet_Out: POE_TD0_N, POE_TD0_P, POE_TD1_N, POE_TD1_P, POE_TD2_N, POE_TD2_P, POE_TD3_N, POE_TD3_P
rule Matched Net Lengths [Tolerance = 7.874mil]; net class Ethernet_Out: POE_TD0_N, POE_TD0_P, POE_TD1_N, POE_TD1_P, POE_TD2_N, POE_TD2_P, POE_TD3_N, POE_TD3_P

### Notes on the sheet
- Date:
- Size:
- A3
- Schema:
- Layout:

### Library data of the parts
C500-C507 = 22N/0603/100V/X7R: CAP SM 0603 22nF 100V X7R; Manufacturer: GENERIC; Manufacturer 1: KEMET; Manufacturer Part Number 1: C0603C223K1RAC7867; Absolute Value: 2.2E-8; Eurocircuits GPN: GPC0603223-100; Part Number: 22N/0603/100V/X7R; Package: 0603; Value: 22nF; HelpURL: https://connect.kemet.com:7667/gateway/IntelliData-ComponentDocumentation/1.0/download/datasheet/C0603C223K1RACTU; Supplier 1: Digi-Key; Supplier Part Number 1: 399-C0603C223K1RAC7867CT-ND; Manufacturer Part Number 3: 0603B223K101CT; Supplier 3: LCSC; Supplier Part Number 3: C388010
C508 C509 = 1N/1210/2kV: CAP SM 1210 1nF 2kV; Manufacturer: GENERIC; Manufacturer 1: Holy Stone Enterprise Co., Ltd.; Manufacturer Part Number 1: C1210X102K202T; Value: 1N; Absolute Value: 1E-9; Part Number: 1N/1210/2kV; Package: 1210; HelpURL: https://www.holystone.com.tw/downloads/series/10000/1000/45/20220530174254_file1.pdf; Supplier 1: Digi-Key; Supplier Part Number 1: 4587-C1210X102K202TCT-ND; Manufacturer Part Number 3: 1210B102K202NT; Supplier 3: LCSC; Supplier Part Number 3: C2836780
C510 = 100N/0603/100V/X7R: CAP SM 0603 100nF 100V X7R; Manufacturer: GENERIC; Manufacturer 1: Samsung Electro-Mechanics; Manufacturer Part Number 1: CL10B104KC8NNNC; Absolute Value: 2.2E-8; Eurocircuits GPN: GPC0603104-100; Part Number: 100N/0603/100V/X7R; Package: 0603; Value: 100nF; HelpURL: https://mm.digikey.com/Volume0/opasdata/d220001/medias/docus/1296/CL10B104KC8NNNC_Spec.pdf; Supplier 1: Digi-Key; Supplier Part Number 1: 1276-6807-1-ND; Manufacturer Part Number 3: CGA0603X7R104K101JT; Supplier 3: LCSC; Supplier Part Number 3: C6119850
D501 = SMBJ58A: TVS DIODE 58VWM 93.6VC DO214AA; Manufacturer: Littelfuse Inc.; Absolute Value: 58V; Part Number: SMBJ58A; Package: DO-214AA, SMB; Value: SMBJ58A; HelpURL: https://www.littelfuse.com/media?resourcetype=datasheets&itemid=09a6ae9a-73cb-4ac4-acac-e6dab92ab953&filename=littelfuse_tvs_diode_smbj_datasheet.pdf; Manufacturer 1: Littelfuse Inc.; Manufacturer Part Number 1: SMBJ58A; Supplier 1: Digikey; Supplier Part Number 1: SMBJ58ALFCT-ND
J500 J501 = ETH_THT_Vert_Schielded: CONN MOD JACK 8P8C VERT SHIELDED; Manufacturer: GENERIC; Manufacturer 1: Würth; Previous Identity: RJ45 Buchse, Gigabit Ethernet; Package Type: HALO/PBL HFJ11-1G41E-L12RL; Part Number: ETH_THT_Vert_Schielded; HelpURL: https://www.we-online.com/components/products/datasheet/615008160421.pdf; Manufacturer Part Number 1: 615008160421; Supplier 1: Digi-Key; Supplier Part Number 1: 732-615008160421-ND; Manufacturer 3: HCTL; Manufacturer Part Number 3: HC-RJ45-5224-1-4; Supplier 3: LCSC; Supplier Part Number 3: C3010560
J502-J505 = Solder_Jumper_2pin_0.2mm_small: as J400 on sheet PoE_Injector; Part Number: Solder_Jumper_2pin_0.2mm_small
L500 = LAN2VSOPS24351C2: 350µH LAN 1000 Base-T, Power over Ethernet (PoE) Pulswandler 1CT:1CT Oberflächenmontage; Manufacturer: Eaton; Part Number: LAN2VSOPS24351C2; HelpURL: https://www.eaton.com/content/dam/eaton/products/electronic-components/resources/data-sheet/eaton-lan2vsop-1000-base-t-lan-transformer-poe-data-sheet-elx1376-en.pdf; Manufacturer 1: Eaton; Manufacturer Part Number 1: LAN2VSOPS24351C2; Manufacturer 3: CND-tek; Manufacturer Part Number 3: G2412S; Supplier 3: LCSC; Supplier Part Number 3: C2912224; Supplier 1: Digi-Key
R501-R508 = 75R/0603: RES SM 0603 75R; Manufacturer: GENERIC; Manufacturer 1: YAGEO; Manufacturer Part Number 1: RC0603FR-1375RL; Absolute Value: 75; Eurocircuits GPN: GPR060375R; Part Number: 75R/0603; Package: 0603; Value: 75R; HelpURL: https://www.yageo.com/upload/media/product/productsearch/datasheet/rchip/PYu-RC_Group_51_RoHS_L_12.pdf; Supplier 1: Digi-Key; Supplier Part Number 1: 13-RC0603FR-1375RLCT-ND; Manufacturer 2: YAGEO; Manufacturer Part Number 2: RC0603FR-1075RL; Supplier 2: Digi-Key; Supplier Part Number 2: 13-RC0603FR-1075RLCT-ND; Supplier 3: LCSC; Supplier Part Number 3: C112309

## Sheet Interfaces.SchDoc: Raspberry Pi Interface
size A3; CompanyName: FSCH; DrawnBy: ahorat / daniw; Engineer: ahorat / daniw; Address1: FS Switzerland; Address2: Zeltweg 57; Address3: 8032 Zürich; SheetNumber: 7; SheetTotal: 9
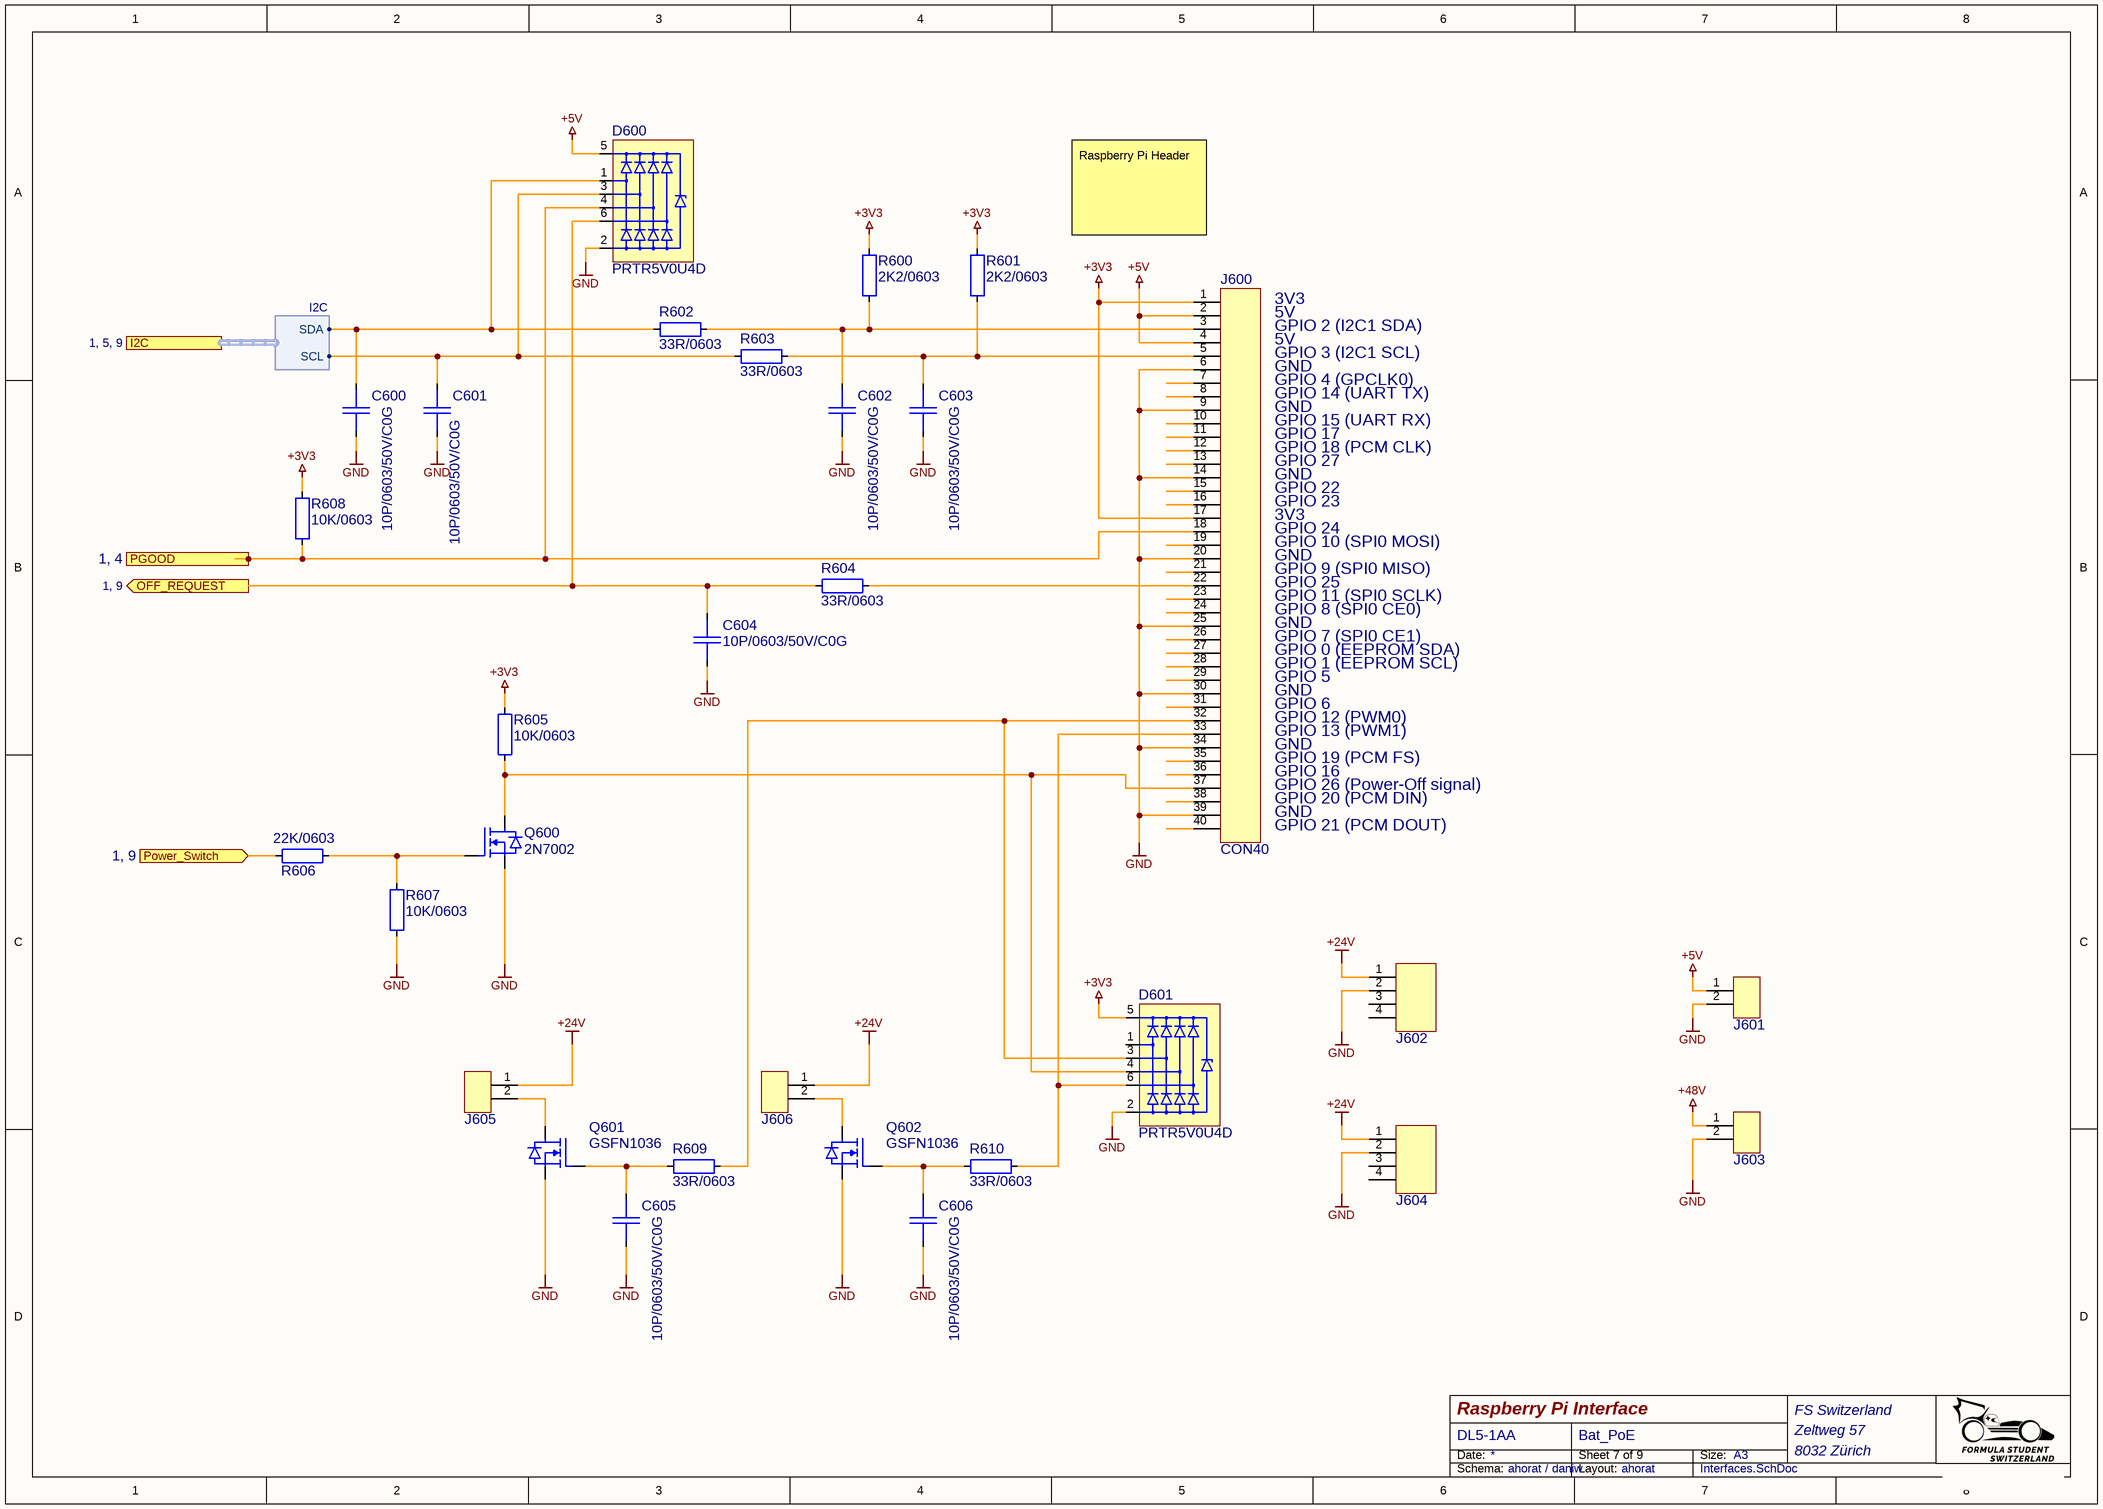
[diagram p7: Interfaces.SchDoc]

### Parts
C600  10P/0603/50V/C0G  [CAP0603_C0G]
C601  10P/0603/50V/C0G  [CAP0603_C0G]
C602  10P/0603/50V/C0G  [CAP0603_C0G]
C603  10P/0603/50V/C0G  [CAP0603_C0G]
C604  10P/0603/50V/C0G  [CAP0603_C0G]
C605  10P/0603/50V/C0G  [CAP0603_C0G]
C606  10P/0603/50V/C0G  [CAP0603_C0G]
D600  PRTR5V0U4D  [SOT2395P280X125-6-NW]
D601  PRTR5V0U4D  [SOT2395P280X125-6-NW]
J600  CON40  [HEAD_254_2X20_Tray]
J601  5600200220  [5600200220]  (value not drawn)
J602  430450412  [430450412]  (value not drawn)
J603  430450212  [430450212]  (value not drawn)
J604  430450412  [430450412]  (value not drawn)
J605  5600200220  [5600200220]  (value not drawn)
J606  5600200220  [5600200220]  (value not drawn)
Q600  2N7002  [SOT2395P280X125-3-SE]
Q601  GSFN1036  [SON065P330X330X075-5-TH245X175]
Q602  GSFN1036  [SON065P330X330X075-5-TH245X175]
R600  2K2/0603  [R0603-0.40-WW]
R601  2K2/0603  [R0603-0.40-WW]
R602  33R/0603  [R0603-0.40-WW]
R603  33R/0603  [R0603-0.40-WW]
R604  33R/0603  [R0603-0.40-WW]
R605  10K/0603  [R0603-0.40-WW]
R606  22K/0603  [R0603-0.40-WW]
R607  10K/0603  [R0603-0.40-WW]
R608  10K/0603  [R0603-0.40-WW]
R609  33R/0603  [R0603-0.40-WW]
R610  33R/0603  [R0603-0.40-WW]

### Ports
I2C (harness I2C, see 1, 5, 9), OFF_REQUEST (out, see 1, 9), PGOOD (in, see 1, 4), Power_Switch (in, see 1, 9)

### Harnesses
I2C: SDA, SCL

### Nets
+3V3: D601.5 J600.1 J600.17 R600.2 R601.2 R605.1 R608.1
+5V: D600.5 J600.2 J600.4 J601.1
+24V: J602.1 J604.1 J605.1 J606.1
+48V: J603.1
GND: C600.2 C601.2 C602.2 C603.2 C604.2 C605.2 C606.2 D600.2 D601.2 J600.6 J600.9 J600.14 J600.20 J600.25 J600.30 J600.34 J600.39 J601.2 J602.2 J603.2 J604.2 Q600.2(SOURCE) Q601.S(SOURCE) Q602.S(SOURCE) R607.2
I2C.SCL: C601.1 D600.3 R603.1 ; port I2C.SCL
I2C.SDA: C600.1 D600.1 R602.1 ; port I2C.SDA
NetC602_1: C602.1 J600.3 R600.1 R602.2
NetC603_1: C603.1 J600.5 R601.1 R603.2
NetC604_1: C604.1 D600.6 R604.1 ; port OFF_REQUEST
NetC605_1: C605.1 Q601.G(GATE) R609.1
NetC606_1: C606.1 Q602.G(GATE) R610.1
NetD600_4: D600.4 J600.18 R608.2 ; port PGOOD
NetD601_3: D601.3 J600.32 R609.2
NetD601_4: D601.4 J600.37 Q600.3(DRAIN) R605.2
NetD601_6: D601.6 J600.33 R610.2
NetD800_2: R606.1 ; port Power_Switch
NetJ600_22: J600.22 R604.2
NetJ605_2: J605.2 Q601.D(DRAIN)
NetJ606_2: J606.2 Q602.D(DRAIN)
NetQ600_1: Q600.1(GATE) R606.2 R607.1

Not connected (* = marked no-connect by the designer): D601 1; J600 7 8 10 11 12 13 15 16 19 21 23 24 26 27 28 29 31 35 36 38 40; J602 3 4; J604 3 4

### Notes on the sheet
- Raspberry Pi Header
- 3V3
- 5V
- GPIO 2 (I2C1 SDA)
- GPIO 3 (I2C1 SCL)
- GND
- GPIO 4 (GPCLK0)
- GPIO 14 (UART TX)
- GPIO 15 (UART RX)
- GPIO 17
- GPIO 18 (PCM CLK)
- GPIO 27
- GPIO 22
- GPIO 23
- GPIO 24
- GPIO 10 (SPI0 MOSI)
- GPIO 9 (SPI0 MISO)
- GPIO 25
- GPIO 11 (SPI0 SCLK)
- GPIO 8 (SPI0 CE0)
- GPIO 7 (SPI0 CE1)
- GPIO 0 (EEPROM SDA)
- GPIO 1 (EEPROM SCL)
- GPIO 5
- GPIO 6
- GPIO 12 (PWM0)
- GPIO 13 (PWM1)
- GPIO 19 (PCM FS)
- GPIO 16
- GPIO 26 (Power-Off signal)
- GPIO 20 (PCM DIN)
- GPIO 21 (PCM DOUT)
- Date:
- Size:
- A3
- Schema:
- Layout:

### Library data of the parts
C600-C606 = 10P/0603/50V/C0G: CAP SM 0603 10pF 50V C0G; Manufacturer: GENERIC; Manufacturer 1: YAGEO; Manufacturer Part Number 1: CC0603JRNPO9BN100; Absolute Value: 1E-11; Eurocircuits GPN: GPC0603100-C0G; Part Number: 10P/0603/50V/C0G; Package: 0603; Value: 10pF; HelpURL: https://www.yageo.com/upload/media/product/productsearch/datasheet/mlcc/UPY-GP_NP0_16V-to-50V_18.pdf; Supplier 1: Digi-Key; Supplier Part Number 1: 311-1058-1-ND; Manufacturer 2: YAGEO; Manufacturer Part Number 2: CC0603KRNPO9BN100; Supplier 2: Digi-Key; Supplier Part Number 2: 311-4025-1-ND
D600 D601 = PRTR5V0U4D: quadruple rail-to-rail ESD protection 5V; Manufacturer: Nexperia; Manufacturer 1: Nexperia USA Inc.; Manufacturer Part Number 1: PRTR5V0U4D,125; Part Number: PRTR5V0U4D; Package: SC74 SOT-457; Value: PRTR5V0U4D; Absolute Value: 5V; HelpURL: https://assets.nexperia.com/documents/data-sheet/PRTR5V0U4D.pdf; Supplier 1: Digikey; Supplier Part Number 1: 1727-3890-1-ND
J600 = Header_2x20_Tray: Header 100 mil; Manufacturer: GENERIC; Manufacturer 1: On Shore Technology Inc.; Manufacturer Part Number 1: 302-S401; Part Number: Header_2x20_Tray; HelpURL: https://mm.digikey.com/Volume0/opasdata/d220001/medias/docus/6025/302-S.pdf; Supplier 1: Digi-Key; Supplier Part Number 1: ED10529-ND
J601 J605 J606 = DuraClick_1x2_VERT_SMD: DuraClik Wire-to-Board Header, Single Row, Vertical, 2 Circuits, Tin (Sn) Over Nickel, Natural; Manufacturer 1: Molex; Part Number: DuraClick_1x2_VERT_SMD; HelpURL: https://www.molex.com/en-us/products/part-detail/5600200220; Manufacturer Part Number 1: 5600200220; Supplier 1: Digi-Key; Supplier Part Number 1: WM10862CT-ND; Manufacturer: Molex
J602 J604 = Microfit_3.0_2x2_VERT_THT: Micro-Fit 3.0 Vertical Header, 3.00mm Pitch, Dual Row, 4 Circuits, with PCB Polarizing Peg, Tin, Glow-Wire Capable, Black; Manufacturer 1: Molex; Part Number: Microfit_3.0_2x2_VERT_THT; HelpURL: https://tools.molex.com/pdm_docs/sd/430450412_sd.pdf; Manufacturer Part Number 1: 430450412; Supplier 1: Digi-Key; Supplier Part Number 1: WM1790-ND
J603 = Microfit_3.0_1x2_VERT_THT: Micro-Fit 3.0 Vertical Header, 3.00mm Pitch, Dual Row, 2 Circuits, with PCB Polarizing Peg, Tin, Glow-Wire Capable, Black; Manufacturer 1: Molex; Part Number: Microfit_3.0_1x2_VERT_THT; HelpURL: https://tools.molex.com/pdm_docs/ps/PS-43045.pdf; Manufacturer Part Number 1: 430450212; Supplier 1: Digi-Key; Supplier Part Number 1: WM1789-ND
Q600 = 2N7002: as Q404 on sheet PoE_Injector; Part Number: 2N7002; Package: SOT23; HelpURL: https://assets.nexperia.com/documents/data-sheet/2N7002NXAK.pdf; Supplier 1: Digi-Key; Supplier Part Number 1: 1727-8643-1-ND; Manufacturer 3: JSMSEMI; Manufacturer Part Number 3: JSMSEMI; Supplier 3: LCSC; Supplier Part Number 3: C916396; JLC Type: Extended
Q601 Q602 = GSFN1036: as Q400 on sheet PoE_Injector; Part Number: GSFN1036; Package: 8-PowerVDFN; HelpURL: https://goodarksemi.com/docs/datasheets/mosfets/GSFN1036.pdf; Manufacturer 1: Good-Ark Semiconductor; Manufacturer Part Number 1: GSFN1036; Supplier 1: Digi-Key; Supplier Part Number 1: 4786-GSFN1036CT-ND
R600 R601 = 2K2/0603: as R407 on sheet PoE_Injector; Part Number: 2K2/0603; Package: 0603; Value: 2K2; HelpURL: https://www.yageo.com/upload/media/product/app/datasheet/rchip/pyu-rc_group_51_rohs_l.pdf; Supplier 1: Digi-Key; Supplier Part Number 1: 13-RC0603FR-132K2LCT-ND; Manufacturer 2: YAGEO; Manufacturer Part Number 2: RC0603FR-102K2L; Supplier 2: Digi-Key; Supplier Part Number 2: 13-RC0603FR-102K2LCT-ND; Manufacturer 3: YAGEO; Manufacturer Part Number 3: RC0603JR-072K2L; Supplier 3: LCSC; Supplier Part Number 3: C113303
R602-R604 R609 R610 = 33R/0603: RES SM 0603 33R; Manufacturer: GENERIC; Manufacturer 1: YAGEO; Manufacturer Part Number 1: RC0603FR-1333RL; Absolute Value: 33; Eurocircuits GPN: GPR060333R; Part Number: 33R/0603; Package: 0603; Value: 33R; HelpURL: https://www.yageo.com/upload/media/product/app/datasheet/rchip/pyu-rc_group_51_rohs_l.pdf; Supplier 1: Digi-Key; Supplier Part Number 1: 13-RC0603FR-1333RLCT-ND; Manufacturer 2: YAGEO; Manufacturer Part Number 2: RC0603FR-1033RL; Supplier 2: Digi-Key; Supplier Part Number 2: 13-RC0603FR-1033RLCT-ND
R605 R607 R608 = 10K/0603: as R411 on sheet PoE_Injector; Part Number: 10K/0603; Package: 0603; Value: 10K; HelpURL: https://www.yageo.com/upload/media/product/productsearch/datasheet/rchip/PYu-RC_Group_51_RoHS_L_12.pdf; Supplier 1: Digi-Key; Supplier Part Number 1: 13-RC0603FR-1310KLCT-ND; Manufacturer 2: YAGEO; Manufacturer Part Number 2: RC0603FR-1010KL; Supplier 2: Digi-Key; Supplier Part Number 2: 13-RC0603FR-1010KLCT-ND; Manufacturer 3: UNI-ROYAL(Uniroyal Elec); Manufacturer Part Number 3: 0603WAF1002T5E; Supplier 3: LCSC; Supplier Part Number 3: C25804; JLC Type: Basic
R606 = 22K/0603: RES SM 0603 22K; Manufacturer: GENERIC; Manufacturer 1: YAGEO; Manufacturer Part Number 1: RC0603FR-1322KL; Absolute Value: 22000; Eurocircuits GPN: GPR060322K; Part Number: 22K/0603; Package: 0603; Value: 22K; HelpURL: https://www.yageo.com/upload/media/product/app/datasheet/rchip/pyu-rc_group_51_rohs_l.pdf; Supplier 1: Digi-Key; Supplier Part Number 1: 13-RC0603FR-1322KLCT-ND; Manufacturer 2: YAGEO; Manufacturer Part Number 2: RC0603FR-1022KL; Supplier 2: Digi-Key; Supplier Part Number 2: 13-RC0603FR-1022KLCT-ND; Manufacturer 3: UNI-ROYAL(Uniroyal Elec); Manufacturer Part Number 3: 0603WAF2202T5E; Supplier 3: LCSC; Supplier Part Number 3: C31850; JLC Type: Basic

## Sheet RPI_Supply.SchDoc: RPI Supply
size A3; CompanyName: FSCH; DrawnBy: ahorat / daniw; Engineer: ahorat / daniw; Address1: FS Switzerland; Address2: Zeltweg 57; Address3: 8032 Zürich; SheetNumber: 8; SheetTotal: 9
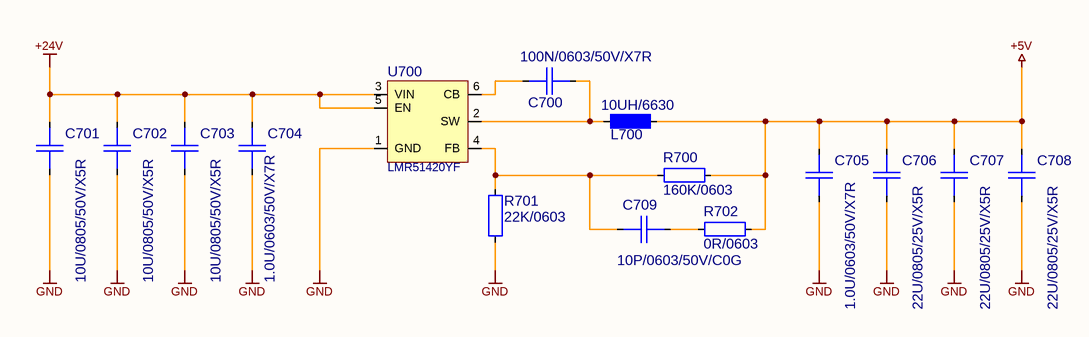
[diagram p8: RPI_Supply.SchDoc]

### Parts
C700  100N/0603/50V/X7R  [CAP0603_X7R]
C701  10U/0805/50V/X5R  [CAP0805_X7R]
C702  10U/0805/50V/X5R  [CAP0805_X7R]
C703  10U/0805/50V/X5R  [CAP0805_X7R]
C704  1.0U/0603/50V/X7R  [CAP0603_X7R]
C705  1.0U/0603/50V/X7R  [CAP0603_X7R]
C706  22U/0805/25V/X5R  [CAP0805_X7R]
C707  22U/0805/25V/X5R  [CAP0805_X7R]
C708  22U/0805/25V/X5R  [CAP0805_X7R]
C709  10P/0603/50V/C0G  [CAP0603_C0G]
L700  10UH/6630  [INDM660730X30]
R700  160K/0603  [R0603-0.40-WW]
R701  22K/0603  [R0603-0.40-WW]
R702  0R/0603  [R0603-0.40-WW]
U700  LMR51420YF  [SOT2395P280X125-6-NW]

### Nets
+5V: C705.1 C706.1 C707.1 C708.1 L700.2 R700.1 R702.2
+24V: C701.1 C702.1 C703.1 C704.1 U700.3(VIN) U700.5(EN)
GND: C701.2 C702.2 C703.2 C704.2 C705.2 C706.2 C707.2 C708.2 R701.1 U700.1(GND)
NetC700_1: C700.1 U700.6(CB)
NetC700_2: C700.2 L700.1 U700.2(SW)
NetC709_1: C709.1 R700.2 R701.2 U700.4(FB)
NetC709_2: C709.2 R702.1

### Notes on the sheet
- Date:
- Size:
- A3
- Schema:
- Layout:

### Library data of the parts
C700 = 100N/0603/50V/X7R: as C101 on sheet Mains; Part Number: 100N/0603/50V/X7R; Package: 0603; Value: 100nF; HelpURL: https://www.yageo.com/upload/media/product/app/datasheet/mlcc/upy-gphc_x7r_6_3v-to-250v.pdf; Supplier 1: Digi-Key; Supplier Part Number 1: 311-3567-1-ND; Manufacturer 2: YAGEO; Manufacturer Part Number 2: CC0603MRX7R9BB104; Supplier 2: Digi-Key; Supplier Part Number 2: 311-4110-1-ND; Supplier 3: LCSC; Supplier Part Number 3: C14663; JLC Type: Basic
C701-C703 = 10U/0805/50V/X5R: as C100 on sheet Mains; Part Number: 10U/0805/50V/X5R; Package: 0805; Value: 10uF; HelpURL: https://search.murata.co.jp/Ceramy/image/img/A01X/G101/ENG/GRM21BR61H106KE43-01A.pdf; Supplier 1: Digi-Key; Supplier Part Number 1: 490-GRM21BR61H106KE43KCT-ND; Manufacturer Part Number 3: GRM21BR61H106KE43L; Supplier 3: LCSC; Supplier Part Number 3: C440198; JLC Type: Basic
C704 C705 = 1.0U/0603/50V/X7R: as C404 on sheet PoE_Injector; Part Number: 1.0U/0603/50V/X7R; Package: 0603; Value: 1.0uF; HelpURL: https://www.yageo.com/upload/media/product/app/datasheet/mlcc/upy-gphc_x7r_6_3v-to-250v.pdf; Supplier 1: Digi-Key; Supplier Part Number 1: 311-2082-1-ND
C706-C708 = 22U/0805/25V/X5R: CAP SM 0805 22uF 25V X5R; Manufacturer: GENERIC; Manufacturer 1: Samsung Electro-Mechanics; Manufacturer Part Number 1: CL21A226MAYNNNE; Absolute Value: 2.2E-5; Eurocircuits GPN: GPN0805106-25; Part Number: 22U/0805/25V/X5R; Package: 0805; Value: 22uF; HelpURL: https://mm.digikey.com/Volume0/opasdata/d220001/medias/docus/339/CL21A226MAYNNNE_Spec.pdf; Supplier 1: Digi-Key; Supplier Part Number 1: 1276-CL21A226MAYNNNECT-ND; Manufacturer Part Number 3: CL21A226MAQNNNE; Supplier 3: LCSC; Supplier Part Number 3: C45783; JLC Type: Basic
C709 = 10P/0603/50V/C0G: as C600 on sheet Interfaces; Part Number: 10P/0603/50V/C0G; Package: 0603; Value: 10pF; HelpURL: https://www.yageo.com/upload/media/product/productsearch/datasheet/mlcc/UPY-GP_NP0_16V-to-50V_18.pdf; Supplier 1: Digi-Key; Supplier Part Number 1: 311-1058-1-ND; Manufacturer 2: YAGEO; Manufacturer Part Number 2: CC0603KRNPO9BN100; Supplier 2: Digi-Key; Supplier Part Number 2: 311-4025-1-ND
L700 = 10UH/6630: FIXED IND 10UH 4A 68 MOHM SMD; Manufacturer: GENERIC; Manufacturer 1: Pulse Electronics; Manufacturer Part Number 1: BMRB00060630100MA1; Absolute Value: 1E-5; Part Number: 10UH/6630; Package: 6030; Value: 10UH; HelpURL: https://productfinder.pulseelectronics.com/api/open/part-attachments/datasheet/BMRB00060630100MA1; Supplier 1: Digi-Key; Supplier Part Number 1: 553-BMRB00060630100MA1CT-ND; Manufacturer 3: Chilisin Elec; Manufacturer Part Number 3: BMRB00060630100MA1; Supplier 3: LCSC; Supplier Part Number 3: C5201679
R700 = 160K/0603: RES SM 0603 160K; Manufacturer: GENERIC; Manufacturer 1: YAGEO; Manufacturer Part Number 1: RC0603FR-13160KL; Absolute Value: 160000; Eurocircuits GPN: GPR0603160K; Part Number: 160K/0603; Package: 0603; Value: 160K; HelpURL: https://www.yageo.com/upload/media/product/productsearch/datasheet/rchip/PYu-RC_Group_51_RoHS_L_12.pdf; Supplier 1: Digi-Key; Supplier Part Number 1: 13-RC0603FR-13160KLCT-ND; Manufacturer 2: YAGEO; Manufacturer Part Number 2: RC0603FR-07160KL; Supplier 2: Digi-Key; Supplier Part Number 2: 311-160KHRCT-ND
R701 = 22K/0603: as R606 on sheet Interfaces; Part Number: 22K/0603; Package: 0603; Value: 22K; HelpURL: https://www.yageo.com/upload/media/product/app/datasheet/rchip/pyu-rc_group_51_rohs_l.pdf; Supplier 1: Digi-Key; Supplier Part Number 1: 13-RC0603FR-1322KLCT-ND; Manufacturer 2: YAGEO; Manufacturer Part Number 2: RC0603FR-1022KL; Supplier 2: Digi-Key; Supplier Part Number 2: 13-RC0603FR-1022KLCT-ND; Manufacturer 3: UNI-ROYAL(Uniroyal Elec); Manufacturer Part Number 3: 0603WAF2202T5E; Supplier 3: LCSC; Supplier Part Number 3: C31850; JLC Type: Basic
R702 = 0R/0603: as R415 on sheet PoE_Injector; Part Number: 0R/0603; Package: 0603; Value: 0R; HelpURL: https://www.yageo.com/upload/media/product/app/datasheet/rchip/pyu-rc_group_51_rohs_l.pdf; Supplier 1: Digi-Key; Supplier Part Number 1: 311-0.0HRCT-ND; Manufacturer 2: YAGEO; Manufacturer Part Number 2: RC0603FR-130RL; Supplier 2: Digi-Key; Supplier Part Number 2: 13-RC0603FR-130RLCT-ND; Manufacturer 3: UNI-ROYAL(Uniroyal Elec); Manufacturer Part Number 3: 0603WAF0000T5E; Supplier 3: LCSC; Supplier Part Number 3: C21189; JLC Type: Basic
U700 = LMR51420YF: SIMPLE SWITCHER® power converter 4.5-V to 36-V, 2-A, synchronous buck with 40-µA IQ; Manufacturer: Texas Instruments; Manufacturer Part Number 1: LMR51420YFDDCR; Part Number: LMR51420YF; Package: SOIC-8; HelpURL: https://www.ti.com/lit/ds/symlink/lmr51420.pdf; Manufacturer 1: Texas Instruments; Supplier 1: Digi-Key; Supplier Part Number 1: 296-LMR51420YFDDCRCT-ND; Manufacturer 3: Texas Instruments; Manufacturer Part Number 3: LMR51420YFDDCR; Supplier 3: LCSC; Supplier Part Number 3: C7296200